# Altium schematic sheet p1_control_block.SchDoc
size A2; Organization: Protel International P/L; Address1: L3, 12a Rodborough Rd; Address2: Frenchs Forest; Address3: NSW; Address4: Australia 2086
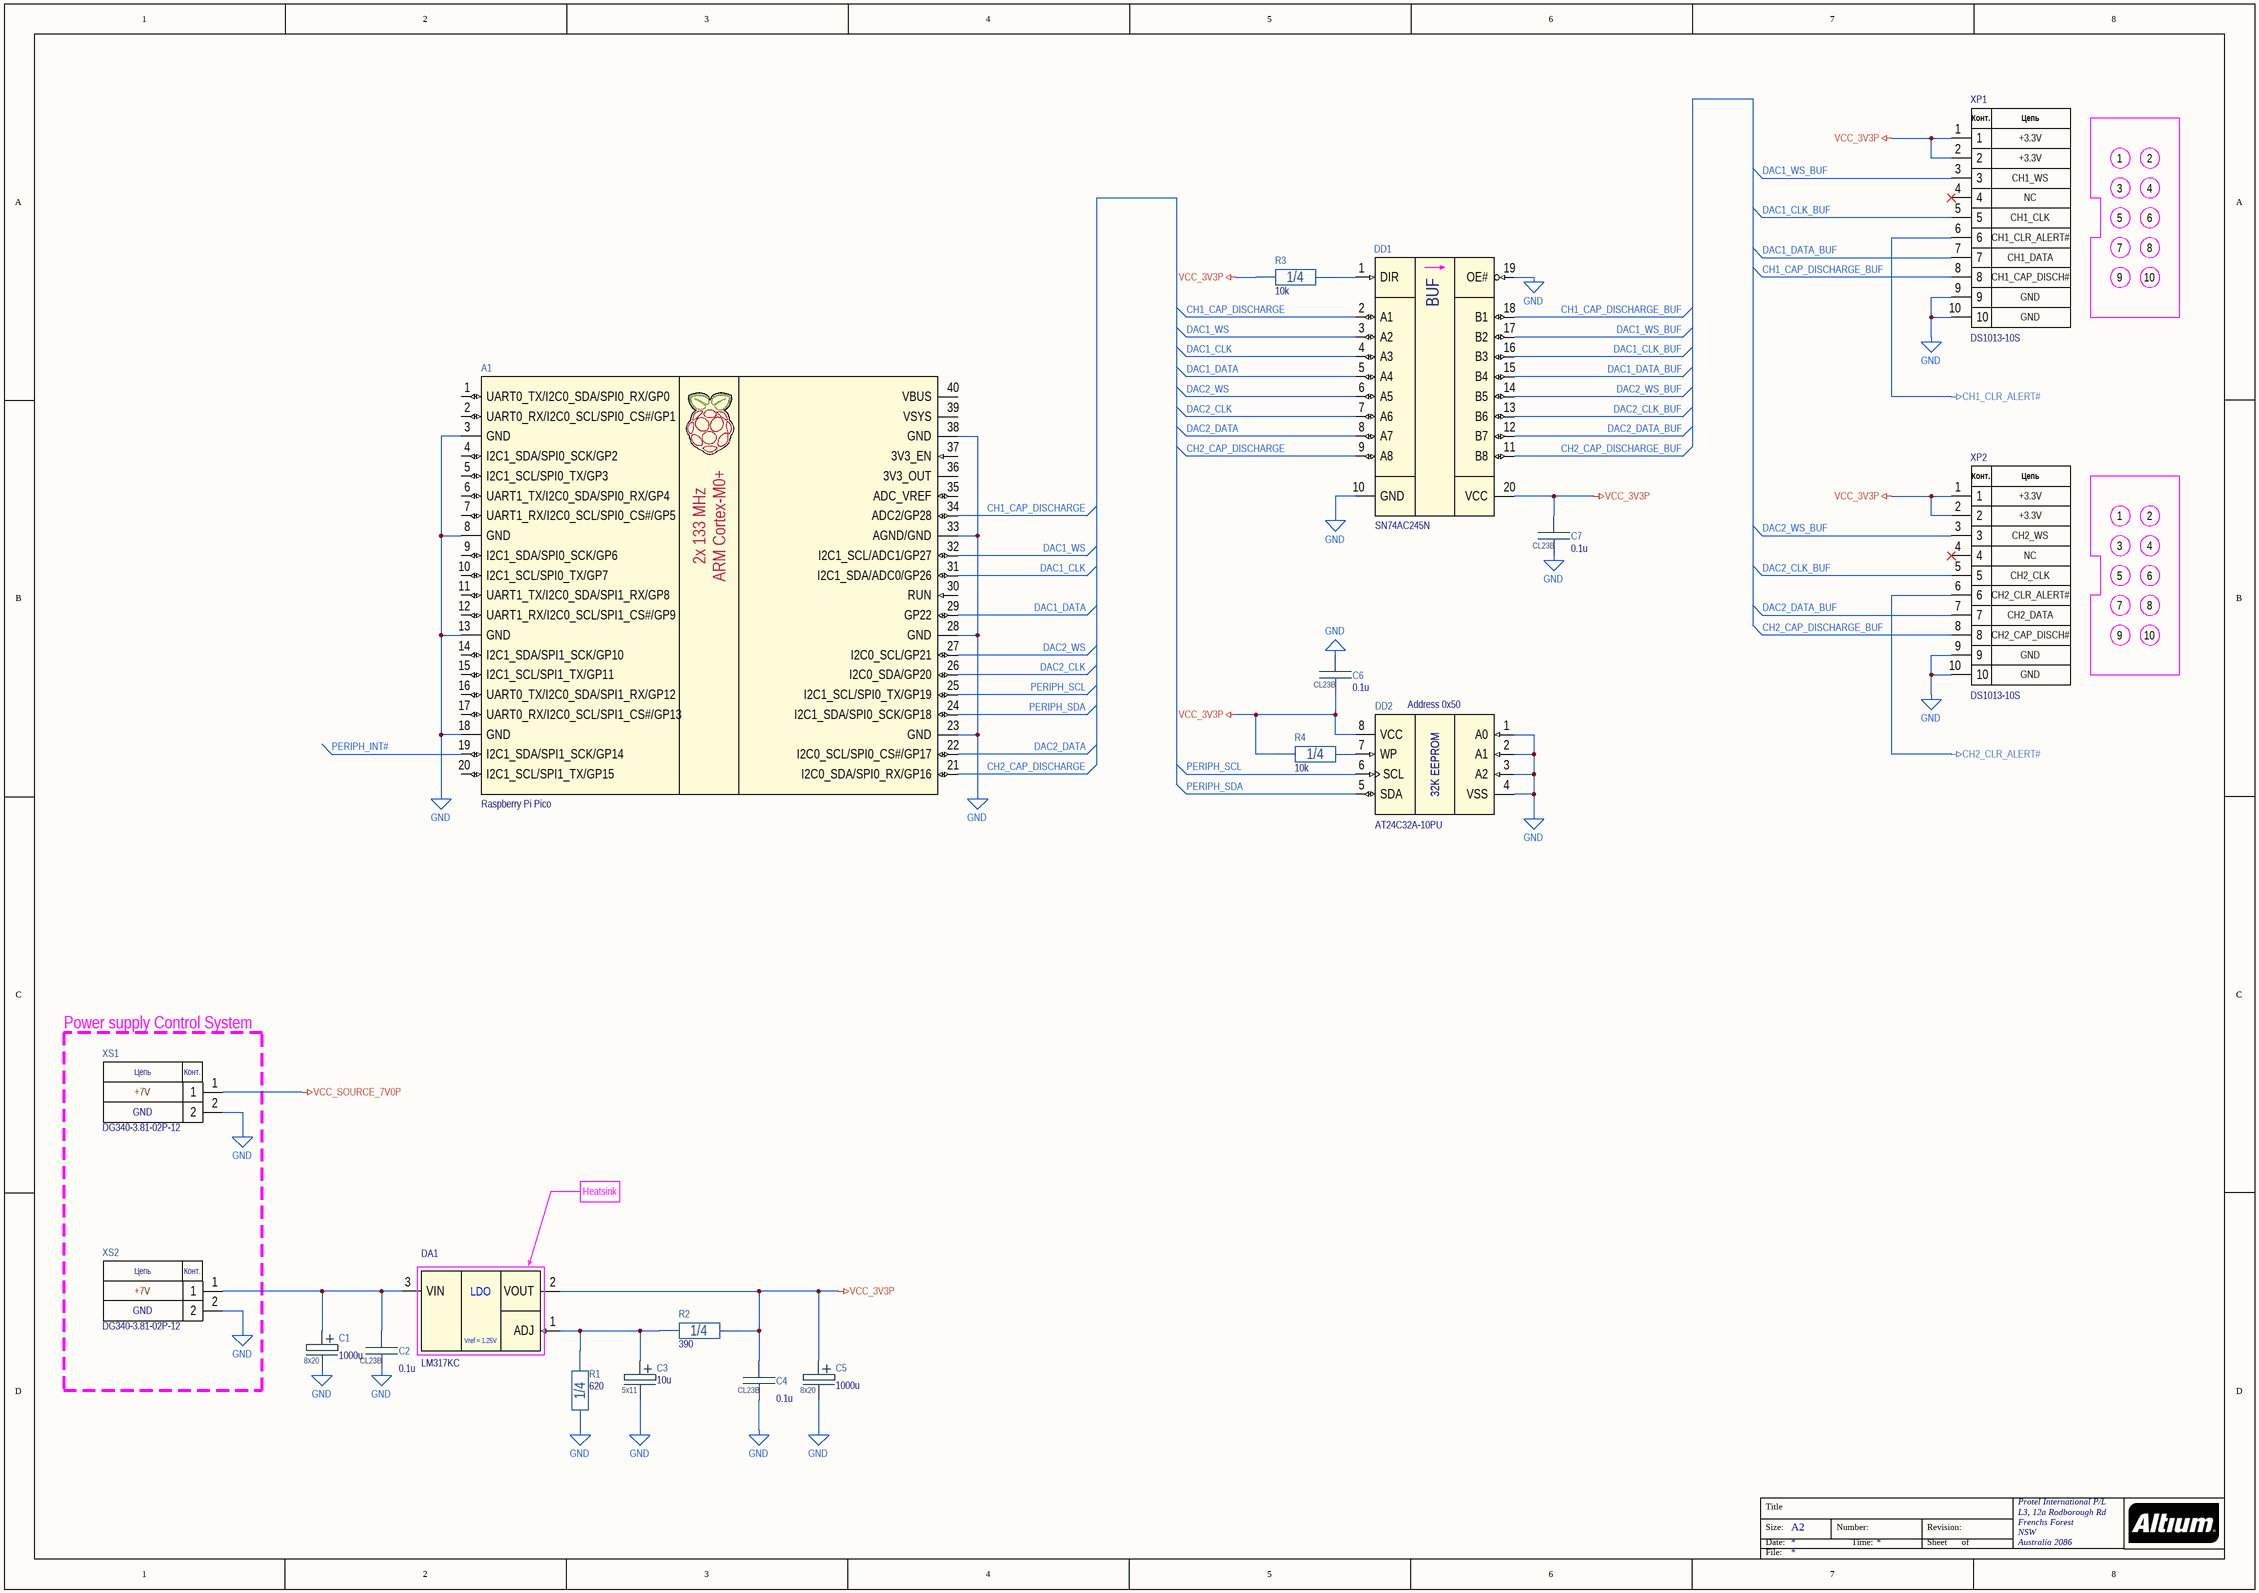
[diagram p0: p1_control_block.SchDoc]

## Parts
A1  Raspberry Pi Pico  [Raspberry_Pi_Pico]
C1  1000u  Package: 8x20  [ECAP8X20X3.5_BRW]
C2  0.1u  [CL23B_7.2x2.5]
C3  10u  Package: 5x11  [ECAP5X11X2.0_BRW]
C4  0.1u  [CL23B_7.2x2.5]
C5  1000u  Package: 8x20  [ECAP8X20X3.5_BRW]
C6  0.1u  [CL23B_7.2x2.5]
C7  0.1u  [CL23B_7.2x2.5]
DA1  LM317KC  [TO-220A-3]
DD1  SN74AC245N  [DIP-20P-M01]
DD2  AT24C32A-10PU  [DIP-8P-M01_with_SO8]
R1  620  Package: 1/4  [CFR-25]
R2  390  Package: 1/4  [CFR-25]
R3  10k  Package: 1/4  [CFR-25]
R4  10k  Package: 1/4  [CFR-25]
XP1  DS1013-10S  [BH-10]
XP2  DS1013-10S  [BH-10]
XS1  DG340-3.81-02P-12  [DG340-3.81-02P]
XS2  DG340-3.81-02P-12  [DG340-3.81-02P]

## Blocks framed on the sheet
Power supply Control System: XS1 XS2

## Nets
CH1_CLR_ALERT#: XP1.6
CH2_CLR_ALERT#: XP2.6
GND: A1.3(GND) A1.8(GND) A1.13(GND) A1.18(GND) A1.23(GND) A1.28(GND) A1.33(AGND/GND) A1.38(GND) C1.2 C2.2 C3.2 C4.2 C5.2 C6.1 C7.2 DD1.10(GND) DD1.19(OE#) DD2.1(A0) DD2.2(A1) DD2.3(A2) DD2.4(VSS) R1.1 XP1.9 XP1.10 XP2.9 XP2.10 XS1.2 XS2.2
VCC_3V3P: C4.1 C5.1 C6.2 C7.1 DA1.2(VOUT) DD1.20(VCC) DD2.8(VCC) R2.1 R3.1 R4.1 XP1.1 XP1.2 XP2.1 XP2.2
VCC_SOURCE_7V0P: XS1.1
CH1_CAP_DISCHARGE: A1.34(ADC2/GP28) DD1.2(A1)
CH1_CAP_DISCHARGE_BUF: DD1.18(B1) XP1.8
CH2_CAP_DISCHARGE: A1.21(I2C0_SDA/SPI0_RX/GP16) DD1.9(A8)
CH2_CAP_DISCHARGE_BUF: DD1.11(B8) XP2.8
DAC1_CLK: A1.31(I2C1_SDA/ADC0/GP26) DD1.4(A3)
DAC1_CLK_BUF: DD1.16(B3) XP1.5
DAC1_DATA: A1.29(GP22) DD1.5(A4)
DAC1_DATA_BUF: DD1.15(B4) XP1.7
DAC1_WS: A1.32(I2C1_SCL/ADC1/GP27) DD1.3(A2)
DAC1_WS_BUF: DD1.17(B2) XP1.3
DAC2_CLK: A1.26(I2C0_SDA/GP20) DD1.7(A6)
DAC2_CLK_BUF: DD1.13(B6) XP2.5
DAC2_DATA: A1.22(I2C0_SCL/SPI0_CS#/GP17) DD1.8(A7)
DAC2_DATA_BUF: DD1.12(B7) XP2.7
DAC2_WS: A1.27(I2C0_SCL/GP21) DD1.6(A5)
DAC2_WS_BUF: DD1.14(B5) XP2.3
PERIPH_INT#: A1.19(I2C1_SDA/SPI1_SCK/GP14)
PERIPH_SCL: A1.25(I2C1_SCL/SPI0_TX/GP19) DD2.6(SCL)
PERIPH_SDA: A1.24(I2C1_SDA/SPI0_SCK/GP18) DD2.5(SDA)
NetC1_1: C1.1 C2.1 DA1.3(VIN) XS2.1
NetC3_1: C3.1 DA1.1(ADJ) R1.2 R2.2
NetDD1_1: DD1.1(DIR) R3.2
NetDD2_7: DD2.7(WP) R4.2

Not connected (* = marked no-connect by the designer): A1 1(UART0_TX/I2C0_SDA/SPI0_RX/GP0) 2(UART0_RX/I2C0_SCL/SPI0_CS#/GP1) 4(I2C1_SDA/SPI0_SCK/GP2) 5(I2C1_SCL/SPI0_TX/GP3) 6(UART1_TX/I2C0_SDA/SPI0_RX/GP4) 7(UART1_RX/I2C0_SCL/SPI0_CS#/GP5) 9(I2C1_SDA/SPI0_SCK/GP6) 10(I2C1_SCL/SPI0_TX/GP7) 11(UART1_TX/I2C0_SDA/SPI1_RX/GP8) 12(UART1_RX/I2C0_SCL/SPI1_CS#/GP9) 14(I2C1_SDA/SPI1_SCK/GP10) 15(I2C1_SCL/SPI1_TX/GP11) 16(UART0_TX/I2C0_SDA/SPI1_RX/GP12) 17(UART0_RX/I2C0_SCL/SPI1_CS#/GP13) 20(I2C1_SCL/SPI1_TX/GP15) 30(RUN) 35(ADC_VREF) 36(3V3_OUT) 37(3V3_EN) 39(VSYS) 40(VBUS); XP1 4*; XP2 4*

## Notes on the sheet
- +3.3V
- CH1_WS
- NC
- 1
- 3
- 2
- 4
- CH1_CLK
- (near XP1) CH1_CLR_ALERT#
- 5
- 7
- 6
- 8
- GND
- (near XP1) CH1_DATA
- (near XP1) CH1_CAP_DISCH#
- 9
- 10
- CH2_WS
- CH2_CLK
- (near XP2) CH2_CLR_ALERT#
- (near XP2) CH2_DATA
- (near XP2) CH2_CAP_DISCH#
- (near DD2) Address 0x50
- +7V
- Heatsink
- Title
- Size:
- Date:
- File:
- A2
- Number:
- Time:
- Revision:
- Sheet
- of
- (in symbol AT24C32A-10PU) 32K EEPROM
- (in symbol BH-10) Конт.; Цепь
- (in symbol DG340-3.81-02P-12) Цепь; Конт.
- (in symbol LM317KC) LDO; Vref = 1.25V
- (in symbol Raspberry Pi Pico) 2x 133 MHz; ARM Cortex-M0+
- (in symbol SN74AC245N) BUF

## Library data of the parts
A1 = Raspberry Pi Pico: Board Raspberry Pi Pico; Part Number: Raspberry Pi Pico; Manufacturer: Raspberry Pi
C1 C5 = C_ECAP: Aluminium capacitor; Part Number: UHV1C102MPD6; Manufacturer: Nichicon; Tolerance: ± 20 %; Voltage: 16V; Value: 1000u; Value on schem: 1000u
C2 C4 C6 C7 = CL23B: Box-type metallized polyester film capacitor; Tolerance: ± * %; Voltage: 63V; Value: 0.1u; Dielectric: Polyester; Value on schem: 0.1u; Part Number: *; Manufacturer: *; Package: CL23B
C3 = C_ECAP: Aluminium capacitor; Part Number: UVR1J100MDD1TA; Manufacturer: Nichicon; Tolerance: ± 20 %; Voltage: 63V; Value: 10u; Value on schem: 10u
DA1 = LM317KC: 1.5 A 3-Terminal Adjustable Regulator; Manufacturer: Texas Instruments; Package: TO-220; Part Number: LM317KC
DD1 = SN74AC245N: 8-bit Bus Transceiver with 3-state outputs; Manufacturer: Texas Instruments; Part Number: SN74AC245N; Package: DIP-20
DD2 = AT24C32A-10PU: 32K I2C Serial EEPROM; Manufacturer: Microchip Technology; Package: DIP-8; Part Number: AT24C32A-10PU
R1 = CF25: Resistor 1/4W; Part Number: MFR-25FTF52-620R; Manufacturer: Yageo; Tolerance: ± 1 %; Voltage: 250V; Temperature Coefficient: ±100 ppm/°C; Value: 620; Value on schem: 620
R2 = CF25: Resistor 1/4W; Part Number: MFR-25FTF52-390R; Manufacturer: Yageo; Tolerance: ± 1 %; Voltage: 250V; Temperature Coefficient: ±100 ppm/°C; Value: 390; Value on schem: 390
R3 R4 = CF25: Resistor 1/4W; Part Number: MFR-25FTF52-10K; Manufacturer: Yageo; Tolerance: ± 1 %; Voltage: 250V; Temperature Coefficient: ±100 ppm/°C; Value: 10k; Value on schem: 10k
XP1 XP2 = BH-10: 10-pin 2.54 mm Box header elevator type; Manufacturer: Connfly; Part Number: DS1013-10S
XS1 XS2 = DG340-3.81-02P-12: 2-way screw terminal, pitch 150mils (3.81mm); Manufacturer: DEGSON; Part Number: DG340-3.81-02P-12